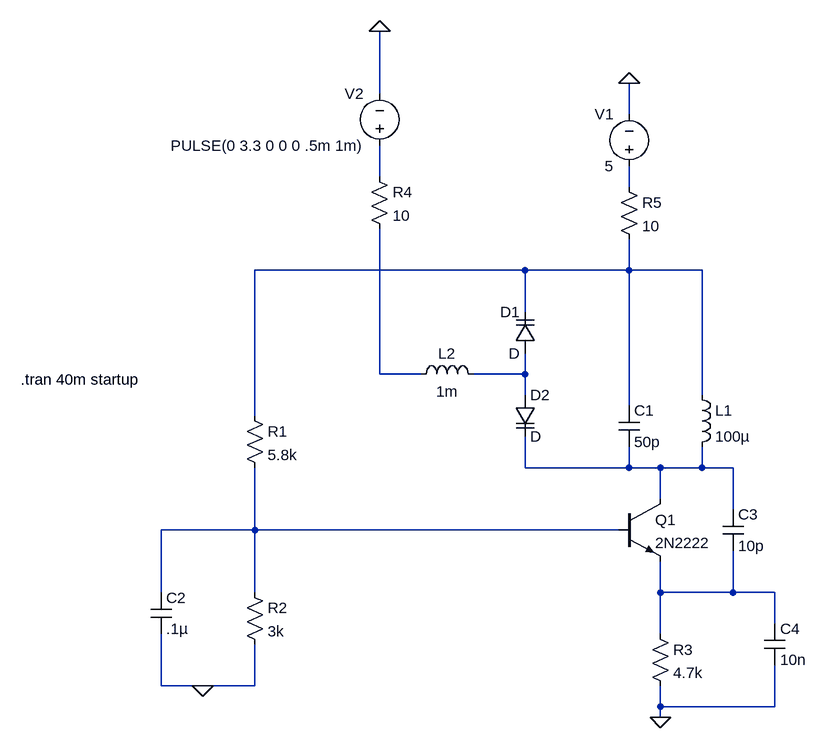
[diagram p0: schematic osc-basecomun.asc]
osc-basecomun.asc, the LTspice schematic file:
Version 4
SHEET 1 880 696
WIRE -240 -464 -240 -560
WIRE 144 -432 144 -480
WIRE -240 -336 -240 -384
WIRE 144 -320 144 -352
WIRE -16 -192 -432 -192
WIRE 144 -192 144 -240
WIRE 144 -192 -16 -192
WIRE 256 -192 144 -192
WIRE -16 -128 -16 -192
WIRE -240 -32 -240 -256
WIRE -176 -32 -240 -32
WIRE -16 -32 -16 -64
WIRE -16 -32 -96 -32
WIRE -16 0 -16 -32
WIRE 256 0 256 -192
WIRE 144 16 144 -192
WIRE -432 32 -432 -192
WIRE -16 112 -16 64
WIRE 144 112 144 80
WIRE 144 112 -16 112
WIRE 192 112 144 112
WIRE 256 112 256 80
WIRE 256 112 192 112
WIRE 304 112 256 112
WIRE 192 160 192 112
WIRE 304 176 304 112
WIRE -432 208 -432 112
WIRE -432 208 -576 208
WIRE 128 208 -432 208
WIRE -576 304 -576 208
WIRE -432 304 -432 208
WIRE 192 304 192 256
WIRE 304 304 304 240
WIRE 304 304 192 304
WIRE 368 304 304 304
WIRE 368 352 368 304
WIRE 192 368 192 304
WIRE -576 448 -576 368
WIRE -512 448 -576 448
WIRE -432 448 -432 384
WIRE -432 448 -512 448
WIRE 192 480 192 448
WIRE 368 480 368 416
WIRE 368 480 192 480
WIRE 192 496 192 480
FLAG -512 448 0
FLAG 192 496 0
FLAG 144 -480 0
FLAG -240 -560 0
SYMBOL res -448 16 R0
SYMATTR InstName R1
SYMATTR Value 5.8k
SYMBOL res -448 288 R0
SYMATTR InstName R2
SYMATTR Value 3k
SYMBOL res 176 352 R0
SYMATTR InstName R3
SYMATTR Value 4.7k
SYMBOL cap 128 16 R0
SYMATTR InstName C1
SYMATTR Value 50p
SYMBOL cap -592 304 R0
SYMATTR InstName C2
SYMATTR Value .1µ
SYMBOL ind 240 -16 R0
SYMATTR InstName L1
SYMATTR Value 100µ
SYMBOL voltage 144 -336 R180
WINDOW 0 24 96 Left 2
WINDOW 3 24 16 Left 2
WINDOW 123 0 0 Left 0
WINDOW 39 0 0 Left 0
SYMATTR InstName V1
SYMATTR Value 5
SYMBOL cap 288 176 R0
SYMATTR InstName C3
SYMATTR Value 10p
SYMBOL cap 352 352 R0
SYMATTR InstName C4
SYMATTR Value 10n
SYMBOL npn 128 160 R0
SYMATTR InstName Q1
SYMATTR Value 2N2222
SYMBOL res 128 -336 R0
SYMATTR InstName R5
SYMATTR Value 10
SYMBOL varactor 0 -64 R180
WINDOW 0 24 64 Left 2
WINDOW 3 24 0 Left 2
SYMATTR InstName D1
SYMBOL ind -192 -16 R270
WINDOW 0 32 56 VTop 2
WINDOW 3 5 56 VBottom 2
SYMATTR InstName L2
SYMATTR Value 1m
SYMBOL voltage -240 -368 R180
WINDOW 0 24 96 Left 2
WINDOW 3 24 16 Left 2
WINDOW 123 0 0 Left 0
WINDOW 39 0 0 Left 0
SYMATTR InstName V2
SYMATTR Value PULSE(0 3.3 0 0 0 .5m 1m)
SYMBOL res -256 -352 R0
SYMATTR InstName R4
SYMATTR Value 10
SYMBOL varactor -32 0 R0
SYMATTR InstName D2
TEXT -792 -24 Left 2 !.tran 40m startup

The netlist it stands for:
* osc-basecomun.asc
R1 N003 N007 5.8k
R2 N007 0 3k
R3 N008 0 4.7k
C1 N003 N006 50p
C2 N007 0 .1µ
L1 N003 N006 100µ
V1 N002 0 5
C3 N006 N008 10p
C4 N008 0 10n
Q1 N006 N007 N008 0 2N2222
R5 N002 N003 10
D1 N005 N003 D
L2 N004 N005 1m
V2 N001 0 PULSE(0 3.3 0 0 0 .5m 1m)
R4 N001 N004 10
D2 N005 N006 D
.model D D
.lib standard.dio
.model NPN NPN
.model PNP PNP
.lib standard.bjt
.tran 40m startup
.backanno
.end